# Altium schematic sheet main.SchDoc
size A4
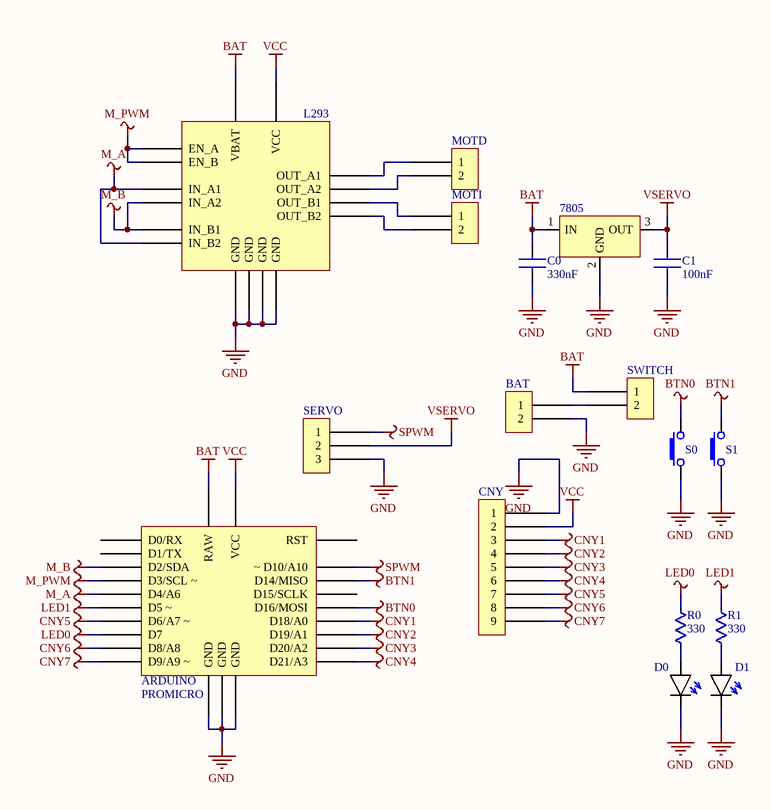
[diagram p0: main.SchDoc]

## Parts
7805  LM78XX  [TO-220-STRAIGHT]  (value not drawn)
ARDUINO  PROMICRO  [PROMICRO]
BAT  (no value)  [HEADER 1x2]
C0  value 330nF  [CAP-CER]  (hidden comment: CAP-CER)
C1  value 100nF  [CAP-CER]  (hidden comment: CAP-CER)
CNY  (no value)  [HEADER 1x9]
D0  LED  [LED-3MM-RED]  (value not drawn)
D1  LED  [LED-3MM-GREEN]  (value not drawn)
L293  L293  [DIP16]  (value not drawn)
MOTD  (no value)  [HEADER 1x2]
MOTI  (no value)  [HEADER 1x2]
R0  value 330  [RES-Axial-400mil]  (hidden comment: RES)
R1  value 330  [RES-Axial-400mil]  (hidden comment: RES)
S0  BUTTON_SMALL_4PIN  [TACT_SWITCH-SMALL-4PIN]  (value not drawn)
S1  BUTTON_SMALL_4PIN  [TACT_SWITCH-SMALL-4PIN]  (value not drawn)
SERVO  (no value)  [Header 1x3]
SWITCH  (no value)  [HEADER 1x2]

## Nets
BAT: 7805.1(IN) ARDUINO.13(RAW) C0.2 L293.16(VBAT) SWITCH.1
BTN0: ARDUINO.23(D16/MOSI) S0.2
BTN1: ARDUINO.22(D14/MISO) S1.2
CNY1: ARDUINO.20(D18/A0) CNY.3
CNY2: ARDUINO.19(D19/A1) CNY.4
CNY3: ARDUINO.18(D20/A2) CNY.5
CNY4: ARDUINO.17(D21/A3) CNY.6
CNY5: ARDUINO.4(D6/A7_~) CNY.7
CNY6: ARDUINO.2(D8/A8) CNY.8
CNY7: ARDUINO.1(D9/A9_~) CNY.9
GND: 7805.2(GND) ARDUINO.9(GND) ARDUINO.10(GND) ARDUINO.14(GND) BAT.2 C0.1 C1.2 CNY.1 D0.K D1.K L293.4(GND) L293.5(GND) L293.12(GND) L293.13(GND) S0.1 S1.1 SERVO.3
LED0: ARDUINO.3(D7) R0.2
LED1: ARDUINO.5(D5_~) R1.2
M_A: ARDUINO.6(D4/A6) L293.2(IN_A1) L293.15(IN_B2)
M_B: ARDUINO.8(D2/SDA) L293.7(IN_A2) L293.10(IN_B1)
M_PWM: ARDUINO.7(D3/SCL_~) L293.1(EN_A) L293.9(EN_B)
SPWM: ARDUINO.24(~_D10/A10) SERVO.1
VCC: ARDUINO.16(VCC) CNY.2 L293.8(VCC)
VSERVO: 7805.3(OUT) C1.1 SERVO.2
NetBAT_1: BAT.1 SWITCH.2
NetD0_A: D0.A R0.1
NetD1_A: D1.A R1.1
NetL293_3: L293.3(OUT_A1) MOTD.1
NetL293_6: L293.6(OUT_A2) MOTD.2
NetL293_11: L293.11(OUT_B1) MOTI.1
NetL293_14: L293.14(OUT_B2) MOTI.2

Not connected (* = marked no-connect by the designer): ARDUINO 11(D0/RX) 12(D1/TX) 15(RST) 21(D15/SCLK)

## Library data of the parts
BAT MOTD MOTI SWITCH = Header 1x2
CNY = Header 1x9
SERVO = Header 1x3